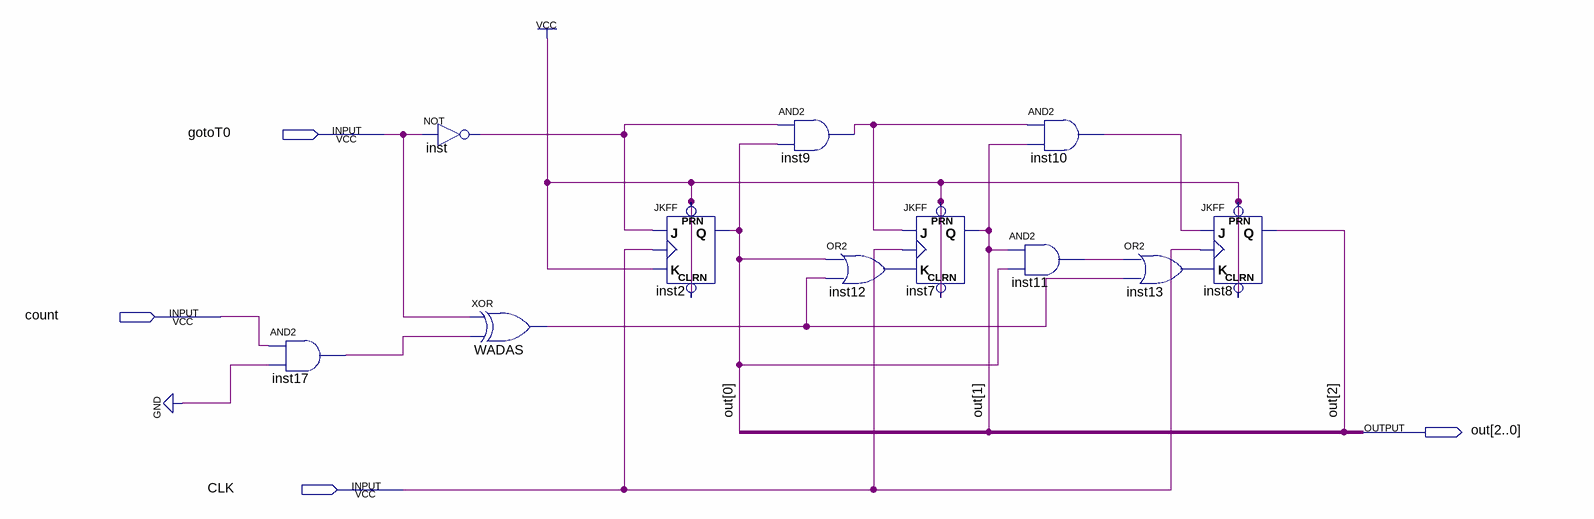
[diagram p0: schematic sheet]
// Quartus schematic contador-3bits.bdf as structural Verilog: 11 symbols, 4 pins
module \contador-3bits  (
  input  gotoT0,
  input  count,
  input  CLK,
  output [2:0] out
);

  wire inst9_out, inst10_out, inst11_out, inst12_out, inst13_out, inst17_out, inst_out, WADAS_out;

  and inst17 (inst17_out, count, 1'b0);
  not inst (inst_out, gotoT0);
  xor WADAS (WADAS_out, gotoT0, inst17_out);
  JKFF inst2 (.PRN(1'b1), .CLRN(1'b1), .K(1'b1), .J(inst_out), .CLK(CLK), .Q(out[0]));
  and inst9 (inst9_out, inst_out, out[0]);
  or inst12 (inst12_out, out[0], WADAS_out);
  JKFF inst7 (.PRN(1'b1), .CLRN(1'b1), .K(inst12_out), .J(inst9_out), .CLK(CLK), .Q(out[1]));
  and inst10 (inst10_out, inst9_out, out[1]);
  and inst11 (inst11_out, out[1], out[0]);
  or inst13 (inst13_out, inst11_out, WADAS_out);
  JKFF inst8 (.PRN(1'b1), .CLRN(1'b1), .K(inst13_out), .J(inst10_out), .CLK(CLK), .Q(out[2]));
endmodule
